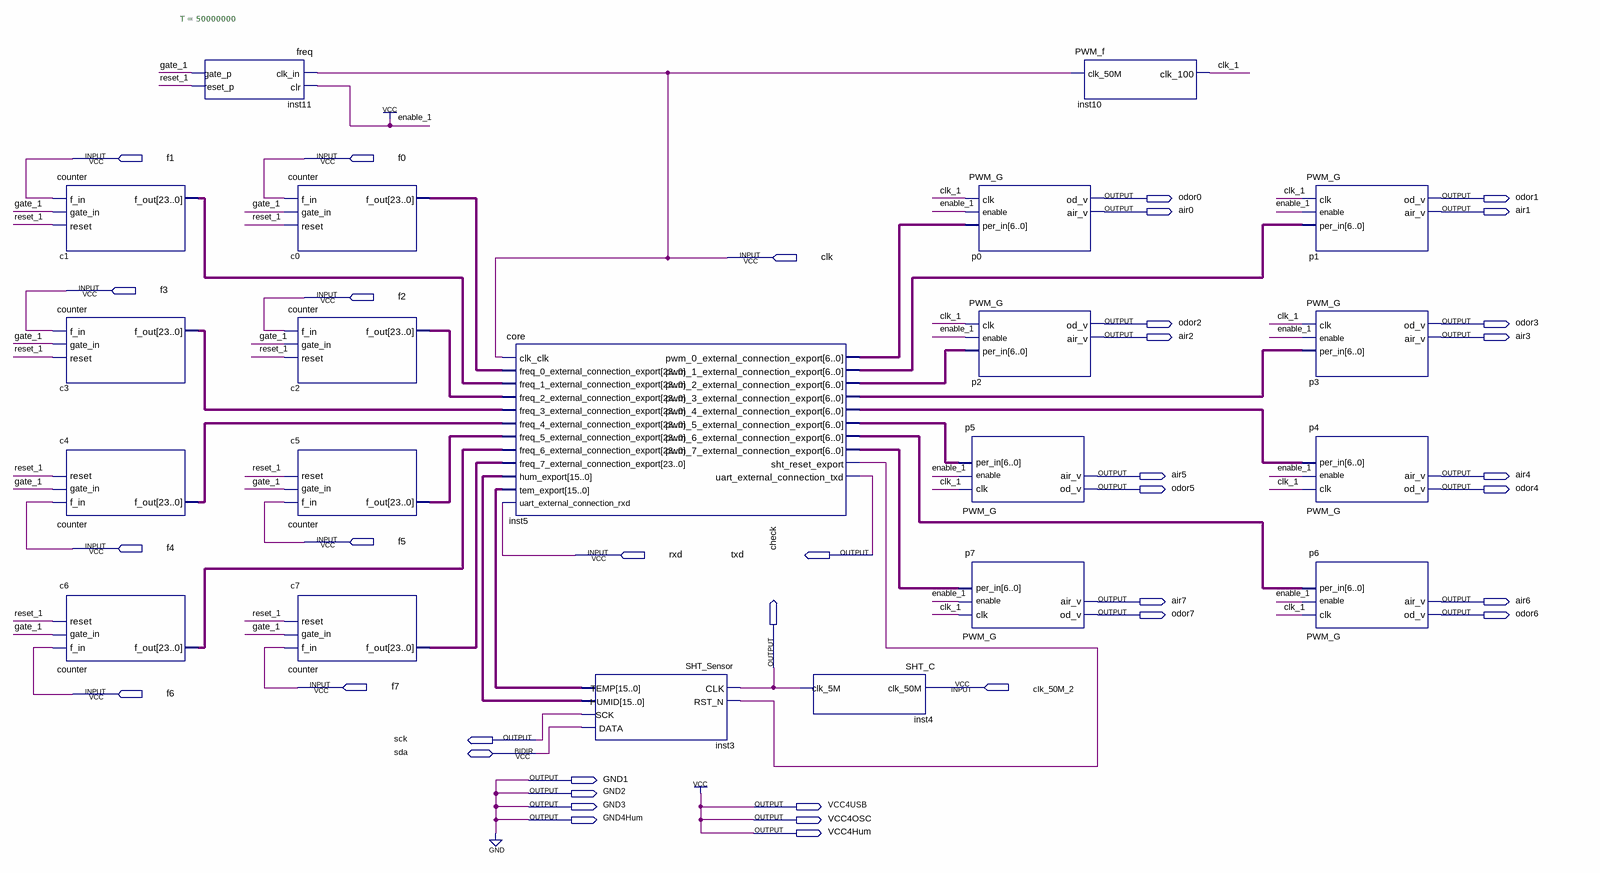
[diagram p0: schematic sheet]
// Quartus schematic system.bdf as structural Verilog: 21 symbols, 38 pins
module system (
  input  f1,
  input  f0,
  input  clk,
  input  f3,
  input  f2,
  input  f5,
  input  f4,
  input  rxd,
  input  f7,
  input  clk_50M_2,
  input  f6,
  inout  sda,
  output odor0,
  output odor1,
  output air0,
  output air1,
  output odor2,
  output odor3,
  output air2,
  output air3,
  output air5,
  output air4,
  output odor5,
  output odor4,
  output txd,
  output air7,
  output air6,
  output odor7,
  output odor6,
  output check,
  output sck,
  output GND1,
  output GND2,
  output GND3,
  output VCC4USB,
  output GND4Hum,
  output VCC4OSC,
  output VCC4Hum
);

  wire clk_1, gate_1, inst5_sht_reset_export, reset_1;
  wire [6:0] inst5_pwm_0_external_connection_export, inst5_pwm_1_external_connection_export,
       inst5_pwm_2_external_connection_export, inst5_pwm_3_external_connection_export,
       inst5_pwm_4_external_connection_export, inst5_pwm_5_external_connection_export,
       inst5_pwm_6_external_connection_export, inst5_pwm_7_external_connection_export;
  wire [15:0] inst3_humid, inst3_temp;
  wire [23:0] c0_f_out, c1_f_out, c2_f_out, c3_f_out, c4_f_out, c5_f_out, c6_f_out, c7_f_out;

  counter c1 (.f_in(f1), .gate_in(gate_1), .reset(reset_1), .f_out(c1_f_out));
  counter c3 (.f_in(f3), .gate_in(gate_1), .reset(reset_1), .f_out(c3_f_out));
  counter c4 (.f_in(f4), .gate_in(gate_1), .reset(reset_1), .f_out(c4_f_out));
  counter c6 (.f_in(f6), .gate_in(gate_1), .reset(reset_1), .f_out(c6_f_out));
  freq #(.T(50000000)) inst11 (.clk_in(clk), .clr(1'b1), .gate_p(gate_1), .reset_p(reset_1));
  counter c0 (.f_in(f0), .gate_in(gate_1), .reset(reset_1), .f_out(c0_f_out));
  counter c2 (.f_in(f2), .gate_in(gate_1), .reset(reset_1), .f_out(c2_f_out));
  counter c5 (.f_in(f5), .gate_in(gate_1), .reset(reset_1), .f_out(c5_f_out));
  counter c7 (.f_in(f7), .gate_in(gate_1), .reset(reset_1), .f_out(c7_f_out));
  core inst5 (
    .clk_clk(clk), .freq_0_external_connection_export(c0_f_out),
    .freq_1_external_connection_export(c1_f_out), .freq_2_external_connection_export(c2_f_out),
    .freq_3_external_connection_export(c3_f_out), .freq_4_external_connection_export(c4_f_out),
    .freq_5_external_connection_export(c5_f_out), .freq_6_external_connection_export(c6_f_out),
    .freq_7_external_connection_export(c7_f_out), .hum_export(inst3_humid), .tem_export(inst3_temp),
    .uart_external_connection_rxd(rxd),
    .pwm_0_external_connection_export(inst5_pwm_0_external_connection_export),
    .pwm_1_external_connection_export(inst5_pwm_1_external_connection_export),
    .pwm_2_external_connection_export(inst5_pwm_2_external_connection_export),
    .pwm_3_external_connection_export(inst5_pwm_3_external_connection_export),
    .pwm_4_external_connection_export(inst5_pwm_4_external_connection_export),
    .pwm_5_external_connection_export(inst5_pwm_5_external_connection_export),
    .pwm_6_external_connection_export(inst5_pwm_6_external_connection_export),
    .pwm_7_external_connection_export(inst5_pwm_7_external_connection_export),
    .sht_reset_export(inst5_sht_reset_export), .uart_external_connection_txd(txd));
  SHT_Sensor inst3 (
    .CLK(check), .RST_N(inst5_sht_reset_export), .TEMP(inst3_temp), .HUMID(inst3_humid), .SCK(sck), .DATA(sda));
  SHT_C inst4 (.clk_50M(clk_50M_2), .clk_5M(check));
  PWM_G p0 (.clk(clk_1), .enable(1'b1), .per_in(inst5_pwm_0_external_connection_export), .od_v(odor0), .air_v(air0));
  PWM_G p2 (.clk(clk_1), .enable(1'b1), .per_in(inst5_pwm_2_external_connection_export), .od_v(odor2), .air_v(air2));
  PWM_G p5 (.clk(clk_1), .enable(1'b1), .per_in(inst5_pwm_5_external_connection_export), .od_v(odor5), .air_v(air5));
  PWM_G p7 (.clk(clk_1), .enable(1'b1), .per_in(inst5_pwm_7_external_connection_export), .od_v(odor7), .air_v(air7));
  PWM_f inst10 (.clk_50M(clk), .clk_100(clk_1));
  PWM_G p1 (.clk(clk_1), .enable(1'b1), .per_in(inst5_pwm_1_external_connection_export), .od_v(odor1), .air_v(air1));
  PWM_G p3 (.clk(clk_1), .enable(1'b1), .per_in(inst5_pwm_3_external_connection_export), .od_v(odor3), .air_v(air3));
  PWM_G p4 (.clk(clk_1), .enable(1'b1), .per_in(inst5_pwm_4_external_connection_export), .od_v(odor4), .air_v(air4));
  PWM_G p6 (.clk(clk_1), .enable(1'b1), .per_in(inst5_pwm_6_external_connection_export), .od_v(odor6), .air_v(air6));

  assign GND1 = 1'b0;
  assign GND2 = 1'b0;
  assign GND3 = 1'b0;
  assign GND4Hum = 1'b0;
  assign VCC4Hum = 1'b1;
  assign VCC4OSC = 1'b1;
  assign VCC4USB = 1'b1;
endmodule
